# EAGLE design amp (EAGLE 6.4)
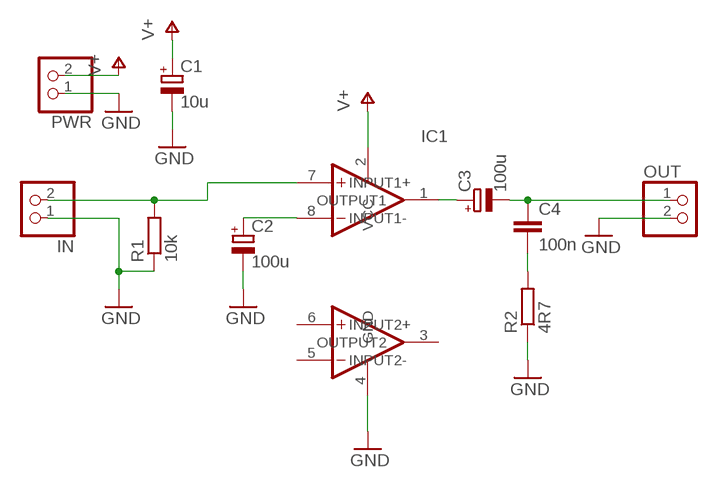
[diagram p0: schematic, sheet 1]

## Parts
C1  10u  CPOL-EUE2.5-5  [E2,5-5]
C2  100u  CPOL-EUE2.5-5  [E2,5-5]
C3  100u  CPOL-EUE2.5-5  [E2,5-5]
C4  100n  C-EUC0805  [C0805]
IC1  TDA2822M  [DIL8]
IN  PINHD-1X2  [1X02]
OUT  PINHD-1X2  [1X02]
PWR  PINHD-1X2  [1X02]
R1  10k  R-EU_R0805  [R0805]
R2  4R7  R-EU_R0805  [R0805]

## Nets
GND: C1.- C2.- IC1.4(GND) IN.1 OUT.2 PWR.1 R1.1 R2.1
N$1: IC1.7(INPUT1+) IN.2 R1.2
N$2: C2.+ IC1.8(INPUT1-)
N$3: C3.+ IC1.1(OUTPUT1)
N$4: C3.- C4.1 OUT.1
N$5: C4.2 R2.2
V+: C1.+ IC1.2(VCC) PWR.2
Unconnected: IC1.3(OUTPUT2) IC1.5(INPUT2-) IC1.6(INPUT2+)

## Library data of the parts
C1-C3 = rcl:CPOL-EU: POLARIZED CAPACITOR, European symbol
C4 = rcl:C-EU: CAPACITOR, European symbol
IC1 = TDA2822M:TDA2822M: TDA2822M - DUAL LOW-VOLTAGE POWER AMPLIFIER
IN OUT PWR = pinhead:PINHD-1X2: PIN HEADER
R1 R2 = rcl:R-EU_: RESISTOR, European symbol

## Board
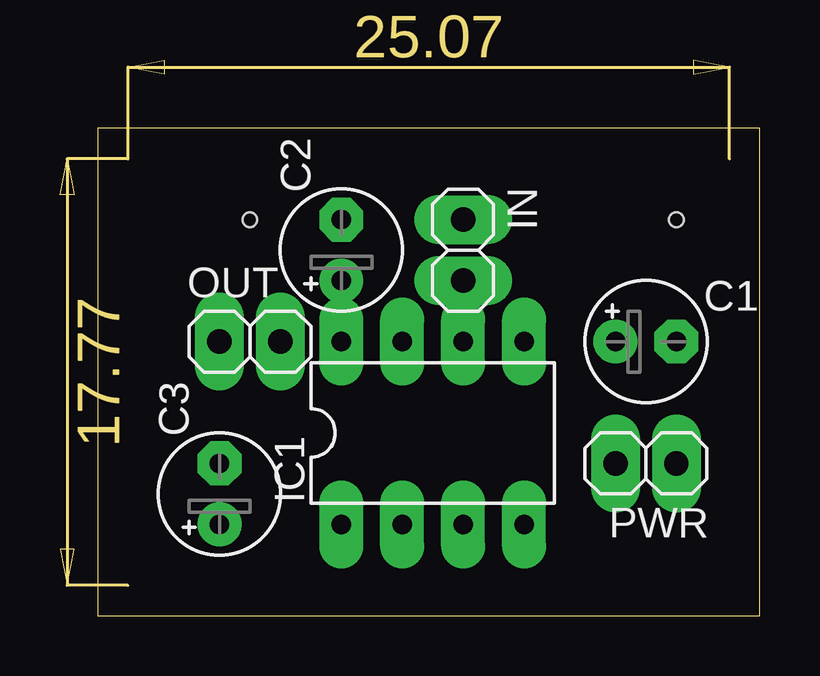
[diagram p1: board, top side]
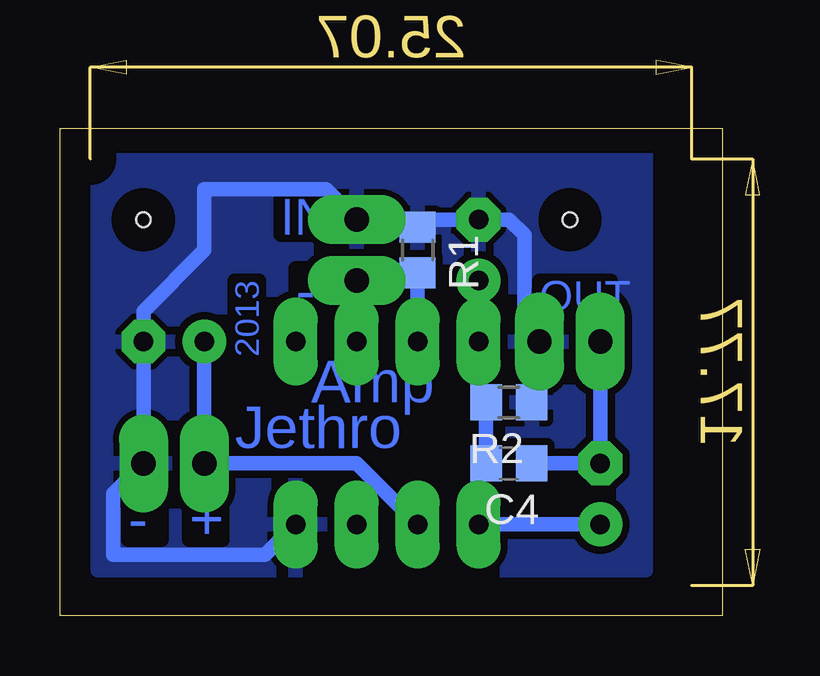
[diagram p2: board, bottom side, seen from below]

Size 27.61 x 20.31 mm. Coordinates in mm from the lower left corner, seen from the top.
Outline: 0,0 27.61,0 27.61,20.31 0,20.31 0,0
Copper layers (1*16): Top 0.035mm / dielectric 1.5mm / Bottom 0.035mm
Design rules "default *": minimum track width 10mil, minimum drill 24mil, track to track 8mil, track to pad 8mil, pad to pad 8mil, via to via 8mil, smd to smd 8mil, copper to edge 40mil, drill to drill 8mil, minimum pad ring 20mil, minimum via ring 16mil, stop-mask expansion 4mil, vias tented up to drill 0mil, thermal gap 10mil
Holes 0.6 mm at 6.35,16.51 24.13,16.51

### Footprints (pad centres in the part's own frame; a part is rotated, then mirrored left to right if it is on the bottom)
E2,5-5 = drill 0.813 pad 1.6: + -1.27,0 | drill 0.813 pad 1.6 octagon: - 1.27,0
C0805 = smd 1.3 x 1.5: 1 -0.95,0; 2 0.95,0
DIL8 = drill 0.813 long: 1 -3.81,-3.81; 2 -1.27,-3.81; 3 1.27,-3.81; 4 3.81,-3.81; 5 3.81,3.81; 6 1.27,3.81; 7 -1.27,3.81; 8 -3.81,3.81
1X02 = drill 1.016 long: 1 -1.27,0; 2 1.27,0
R0805 = smd 1.3 x 1.5: 1 -0.95,0; 2 0.95,0

### Placement (x,y rotation side)
C1  22.86,11.43 0 top
C2  10.16,15.24 90 top
C3  5.08,5.08 90 top
C4  8.89,6.35 180 bottom
IC1  13.97,7.62 0 top
IN  15.24,15.24 270 top
OUT  6.35,11.43 0 top
PWR  22.86,6.35 180 top
R1  12.7,15.24 270 bottom
R2  8.89,8.89 180 bottom

### Tracks (layer width: path | path; a pad name or v marks a point on that pad's centre or on a via)
GND
  Bottom 0.61: OUT.2 7.94,11.43 | 7.94,11.43 R2.1 | IC1.4 19.05,2.54 25.4,2.54 25.4,5.08 PWR.1 C1.- 24.13,12.7 21.59,15.24 21.59,17.78 16.51,17.78 IN.1 13.02,16.51 R1.1 12.38,16.51 C2.- 8.89,16.51 8.26,15.88 8.26,12.06 7.94,11.75 7.94,11.43
  pour Bottom (isolate 0.305): 3.17,19.68 26.04,19.68 26.04,1.91 3.17,1.91
N$1
  Bottom 0.61: IN.2 14.92,14.29 R1.2 IC1.7
N$2
  Bottom 0.61: IC1.8 C2.+
N$3
  Bottom 0.61: IC1.1 C3.+
N$4
  Bottom 0.61: OUT.1 C3.- C4.1
N$5
  Bottom 0.61: R2.2 C4.2
V+
  Bottom 0.61: IC1.2 15.24,6.35 PWR.2 C1.+

### Text on the board
Bottom: IN | 2013 | OUT | - | Amp | Jethro | + | -